# Altium project BMS_V2.1_Adv.PrjPcb (part 2 of 3)

## Sheet Isolated Communication.SchDoc
size A3; SheetNumber: 5; SheetTotal: 12
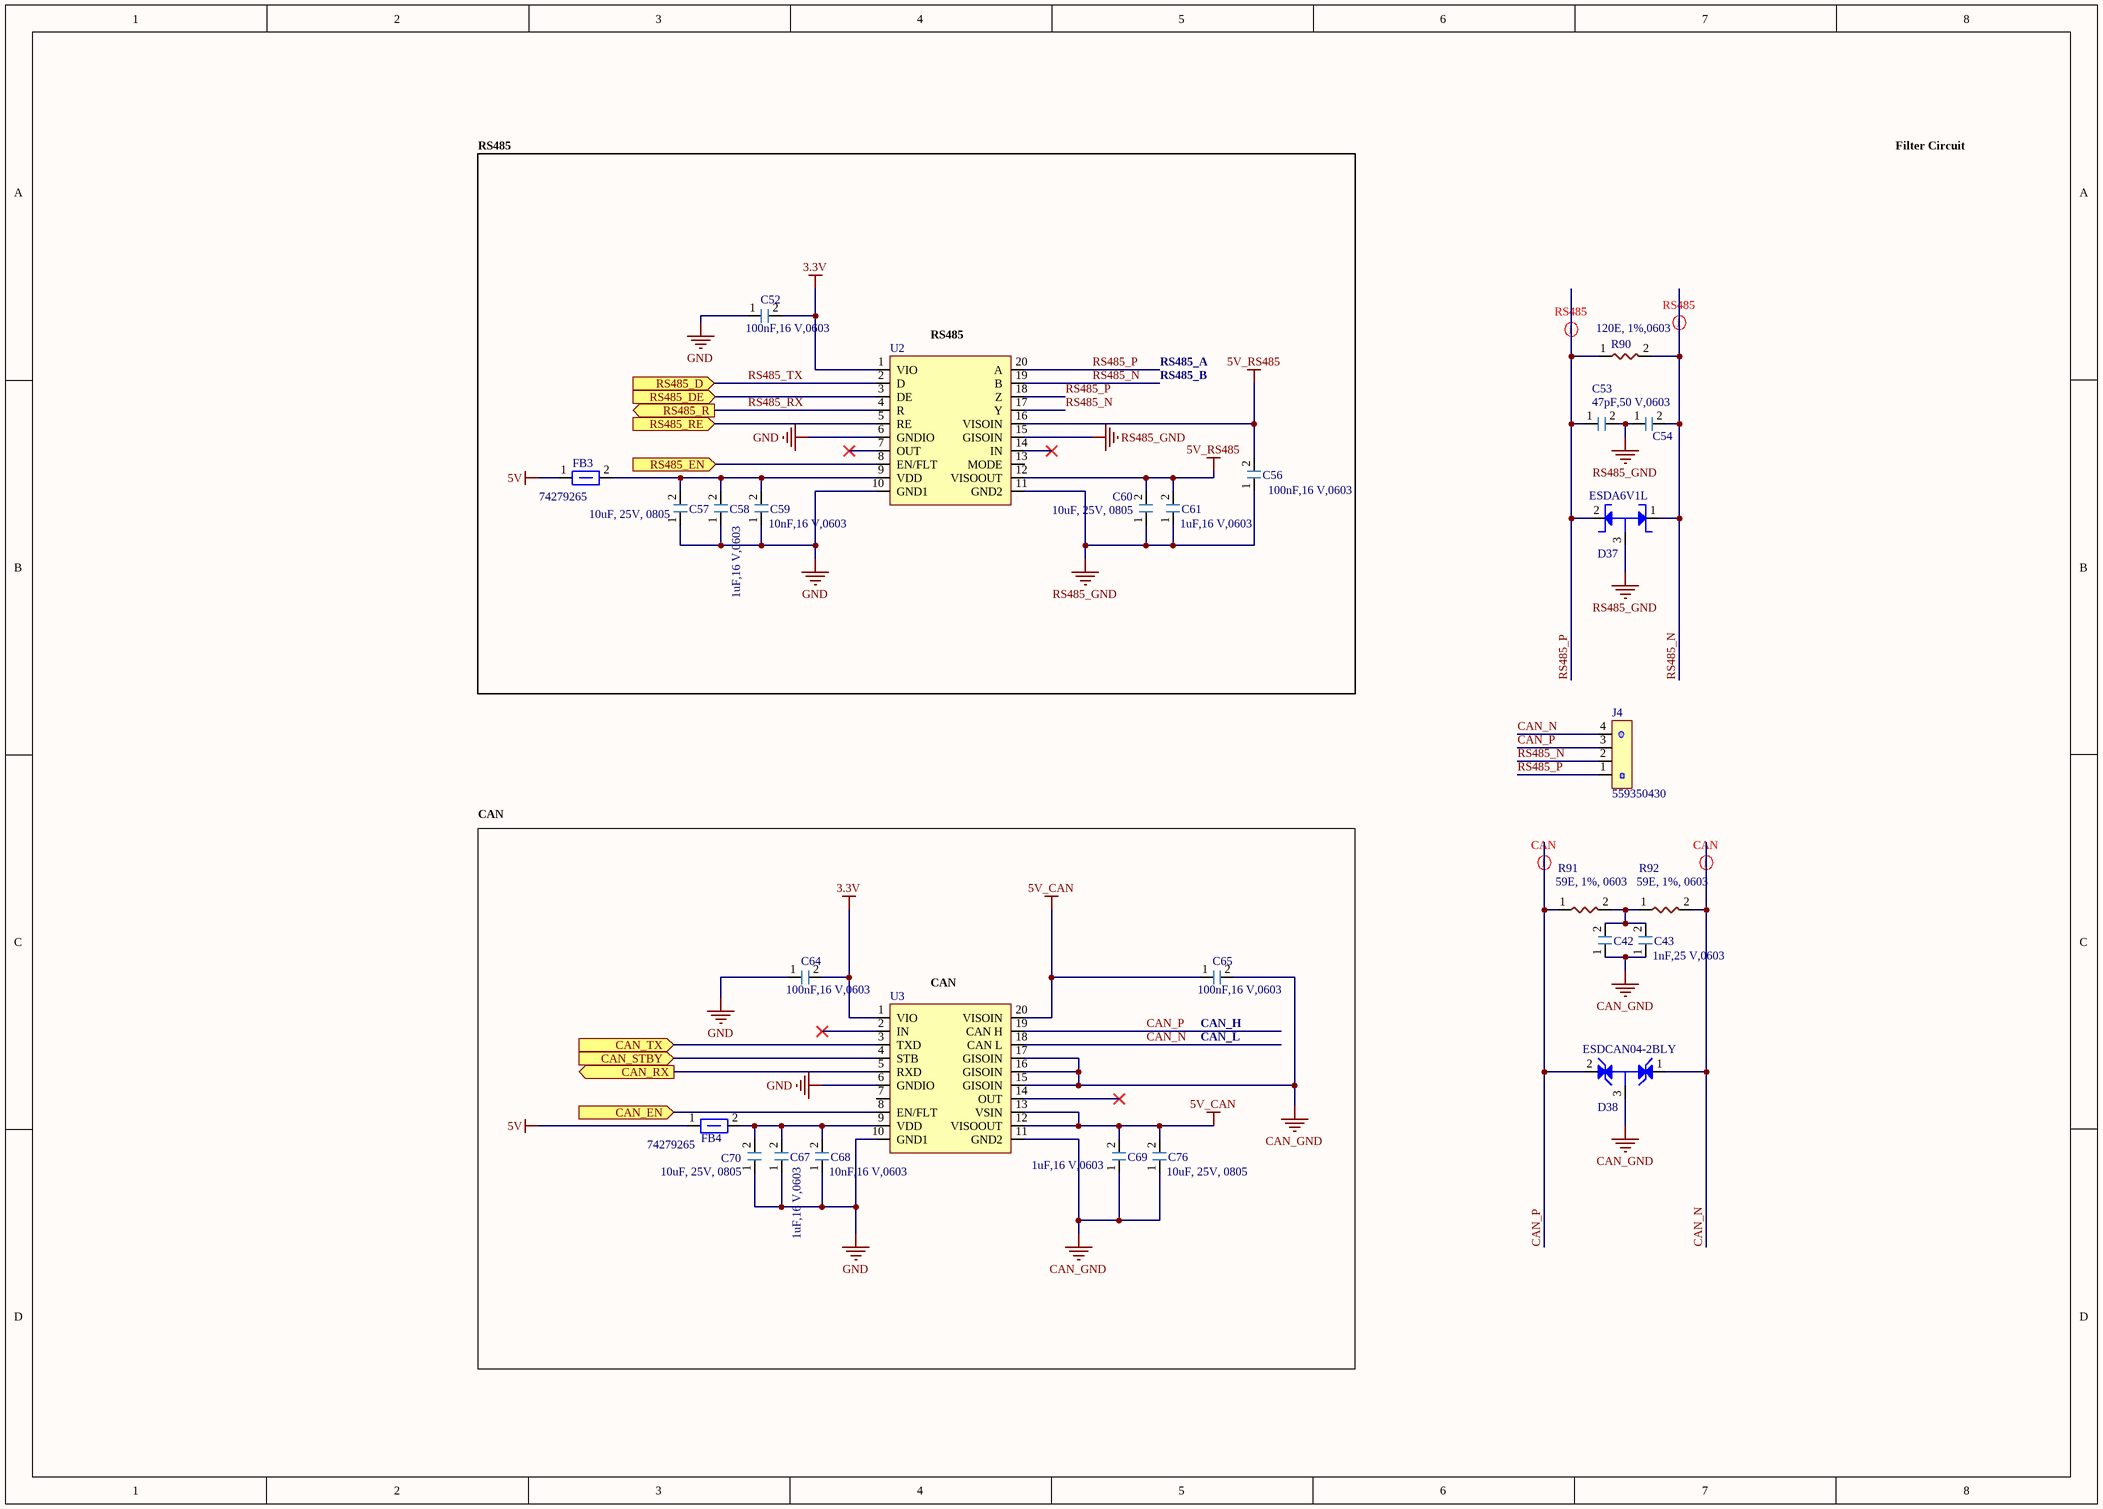
[diagram p4: Isolated Communication.SchDoc]

### Parts
C42  C0603C102J3GACAUTO  [CAPC1608X05N 0603]  (value not drawn)
C43  Value Display: 1nF,25 V,0603  [CAPC1608X05N 0603]  (hidden comment: C0603C102J3GACAUTO)
C52  Value Display: 100nF,16 V,0603  [CAPC1608X05N 0603]  (hidden comment: CC0603KRX7R7BB104)
C53  Value Display: 47pF,50 V,0603  [CAPC1608X05N 0603]  (hidden comment: CC0603JRNPO9BN470)
C54  CC0603JRNPO9BN470  [CAPC1608X05N 0603]  (value not drawn)
C56  Value Display: 100nF,16 V,0603  [CAPC1608X05N 0603]  (hidden comment: CC0603KRX7R7BB104)
C57  Value Display: 10uF, 25V, 0805  [CAPC2012X13N 0805]  (hidden comment: GRM21BZ71E106KE15L)
C58  Value Display: 1uF,16 V,0603  [CAPC1608X05N 0603]  (hidden comment: CGA3E1X7R1C105K080AC)
C59  Value Display: 10nF,16 V,0603  [CAPC1608X05N 0603]  (hidden comment: C0603C103K4RECTU)
C60  Value Display: 10uF, 25V, 0805  [CAPC2012X13N 0805]  (hidden comment: GRM21BZ71E106KE15L)
C61  Value Display: 1uF,16 V,0603  [CAPC1608X05N 0603]  (hidden comment: CGA3E1X7R1C105K080AC)
C64  Value Display: 100nF,16 V,0603  [CAPC1608X05N 0603]  (hidden comment: CC0603KRX7R7BB104)
C65  Value Display: 100nF,16 V,0603  [CAPC1608X05N 0603]  (hidden comment: CC0603KRX7R7BB104)
C67  Value Display: 1uF,16 V,0603  [CAPC1608X05N 0603]  (hidden comment: CGA3E1X7R1C105K080AC)
C68  Value Display: 10nF,16 V,0603  [CAPC1608X05N 0603]  (hidden comment: C0603C103K4RECTU)
C69  Value Display: 1uF,16 V,0603  [CAPC1608X05N 0603]  (hidden comment: CGA3E1X7R1C105K080AC)
C70  Value Display: 10uF, 25V, 0805  [CAPC2012X13N 0805]  (hidden comment: GRM21BZ71E106KE15L)
C76  Value Display: 10uF, 25V, 0805  [CAPC2012X13N 0805]  (hidden comment: GRM21BZ71E106KE15L)
D37  ESDA6V1L  [SOT95P255X140-3N]
D38  ESDCAN04-2BLY  [SOT95P255X125-3N]
FB3  74279265  [RESC1608X05N 0603]
FB4  74279265  [RESC1608X05N 0603]
J4  559350430  [Con_559350430]
R90  Value Display: 120E, 1%,0603  [RESC1608X05N 0603]  (hidden comment: AF0603FR-07120RL)
R91  Value Display: 59E, 1%, 0603  [RESC1608X05N 0603]  (hidden comment: AC0603FR-0759RL)
R92  Value Display: 59E, 1%, 0603  [RESC1608X05N 0603]  (hidden comment: AC0603FR-0759RL)
U2  ISOW1412BDFMR  [SOIC127P1030X355-20N]  (value not drawn)
U3  ISOW1044BDFMR  [SOIC127P1030X355-20N]  (value not drawn)

### Ports
CAN_EN (in), CAN_RX (out), CAN_STBY (in), CAN_TX (in), RS485_D (in), RS485_DE (in), RS485_EN (in), RS485_R (out), RS485_RE (in)

### Nets
3.3V: C52.2 C64.2 U2.1(VIO) U3.1(VIO)
5V: FB3.1 FB4.1
5V_CAN: C65.1 C69.2 C76.2 U3.12(VISOOUT) U3.13(VSIN) U3.20(VISOIN)
5V_RS485: C56.2 C60.2 C61.2 U2.12(VISOOUT) U2.16(VISOIN)
CAN_GND: C42.1 C43.1 C65.2 C69.1 C76.1 D38.3 U3.11(GND2) U3.15(GISOIN) U3.16(GISOIN) U3.17(GISOIN)
GND: C52.1 C57.1 C58.1 C59.1 C64.1 C67.1 C68.1 C70.1 U2.6(GNDIO) U2.10(GND1) U3.6(GNDIO) U3.10(GND1)
RS485_GND: C53.2 C54.1 C56.1 C60.1 C61.1 D37.3(Anode) U2.11(GND2) U2.15(GISOIN)
CAN_EN: U3.8(EN/FLT) ; port CAN_EN
CAN_N: D38.1(Cathode) J4.4 R92.2 U3.18(CAN_L)
CAN_P: D38.2(Anode) J4.3 R91.1 U3.19(CAN_H)
CAN_RX: U3.5(RXD) ; port CAN_RX
CAN_STBY: U3.4(STB) ; port CAN_STBY
CAN_TX: U3.3(TXD) ; port CAN_TX
RS485_DE: U2.3(DE) ; port RS485_DE
RS485_EN: U2.8(EN/FLT) ; port RS485_EN
RS485_N: C54.2 D37.1(Cathode) J4.2 R90.2 U2.17(Y) U2.19(B)
RS485_P: C53.1 D37.2(Cathode) J4.1 R90.1 U2.18(Z) U2.20(A)
RS485_RE: U2.5(RE) ; port RS485_RE
RS485_RX: U2.4(R) ; port RS485_R
RS485_TX: U2.2(D) ; port RS485_D
NetC42_2: C42.2 C43.2 R91.2 R92.1
NetC57_2: C57.2 C58.2 C59.2 FB3.2 U2.9(VDD)
NetC67_2: C67.2 C68.2 C70.2 FB4.2 U3.9(VDD)

Not connected (* = marked no-connect by the designer): U2 7(OUT)* 13(MODE) 14(IN)*; U3 2(IN)* 7 14(OUT)*

### Layout directives
differential pair: CAN_N, CAN_P, RS485_N, RS485_P

### Notes on the sheet
- RS485
- Filter Circuit
- (near U2) RS485
- RS485_A
- RS485_B
- CAN
- (near U3) CAN
- (near C65) CAN_H
- CAN_L

### Library data of the parts
C42 = Cap_C0603C102J3GACAUTO: Multilayer Ceramic Capacitor, 1000 pF, 25V, ±5%,  C0G 0603 [1608 Metric]; Manufacturer: KEMET; Value: 1nF; Max Temp: 125 degC; Min Temp: -55 degC; Polarized: No; Temp Coefficient: C0G, NP0; Value Display: 1nF,25 V,0603; AEC-Q: 200; Manufacturer Part Number: C0603C102J3GACAUTO; Voltage: 25V; Category: Capacitor; ComponentLink1Description: Datasheet; Mount Type: Surface Mount; Package: 0603; RoHS: Yes; Supplier 1: Digikey; Supplier 1 Part Number: 399-C0603C102J3GACAUTOCT-ND; Supplier 1 pricing per Unit: 9.17 INR; Supplier: Mouser; Supplier Part Number: 80-C0603C102J3GAUTO; Supplier pricing per Unit: 8.34 INR; Technology: Ceramic; Tolerance: 5%; Value 1: C0603C102J3GACAUTO; ComponentLink1URL: https://connect.kemet.com:7667/gateway/IntelliData-ComponentDocumentation/1.0/download/datasheet/C0603C102J3GACAUTO
C43 = Cap_C0603C102J3GACAUTO: Multilayer Ceramic Capacitor, 1000 pF, 25V, ±5%,  C0G 0603 [1608 Metric]; Manufacturer: KEMET; Value: 1nF; Max Temp: 125 degC; Min Temp: -55 degC; Polarized: No; Temp Coefficient: C0G, NP0; AEC-Q: 200; Manufacturer Part Number: C0603C102J3GACAUTO; Voltage: 25V; Category: Capacitor; ComponentLink1Description: Datasheet; Mount Type: Surface Mount; Package: 0603; RoHS: Yes; Supplier 1: Digikey; Supplier 1 Part Number: 399-C0603C102J3GACAUTOCT-ND; Supplier 1 pricing per Unit: 9.17 INR; Supplier: Mouser; Supplier Part Number: 80-C0603C102J3GAUTO; Supplier pricing per Unit: 8.34 INR; Technology: Ceramic; Tolerance: 5%; Value 1: C0603C102J3GACAUTO; ComponentLink1URL: https://connect.kemet.com:7667/gateway/IntelliData-ComponentDocumentation/1.0/download/datasheet/C0603C102J3GACAUTO
C52 C56 C64 C65 = Cap_CC0603KRX7R7BB104: Multilayer Ceramic Capacitor, 100 nF, 16V, ±10%,  X7R 0603 [1608 Metric]; Manufacturer: Yageo; Value: 100nF; Max Temp: 125 degC; Min Temp: -55 degC; Polarized: No; AEC-Q: NA; Manufacturer Part Number: CC0603KRX7R7BB104; Category: Capacitor; ComponentLink1Description: Datasheet; Mount Type: Surface Mount; Package: 0603; RoHS: Yes; Supplier 1: Digikey; Supplier 1 Part Number: 311-1088-1-ND; Supplier 1 pricing per Unit: 8.34 INR; Supplier: Mouser; Supplier Part Number: 603-CC603KRX7R7BB104; Supplier pricing per Unit: 8.34 INR; Technology: Ceramic; Temp Coefficient: X7R; Tolerance: 10%; Value 1: CC0603KRX7R7BB104; Voltage: 16V; ComponentLink1URL: https://www.yageo.com/upload/media/product/productsearch/datasheet/mlcc/UPY-GPHC_X7R_6.3V-to-250V_24.pdf
C53 = Cap_CC0603JRNPO9BN470: Multilayer Ceramic Capacitor, 47 pF, 50V, ±5%,  C0G 0603 [1608 Metric]; Manufacturer: Yageo; AEC-Q: NA; Max Temp: 125 degC; Min Temp: -55 degC; Polarized: No; Temp Coefficient: C0G, NP0; Value: 47pF; Manufacturer Part Number: CC0603JRNPO9BN470; Category: Capacitor; ComponentLink1Description: Datasheet; ComponentLink1URL: https://www.yageo.com/upload/media/product/productsearch/datasheet/mlcc/UPY-GP_NP0_16V-to-50V_18.pdf; Mount Type: Surface Mount; Package: 0603; RoHS: Yes; Supplier 1: Digikey; Supplier 1 Part Number: 311-1065-1-ND; Supplier 1 pricing per Unit: 8.34 INR; Supplier: Mouser; Supplier Part Number: 603-CC603JRNPO9BN470; Supplier pricing per Unit: 8.34 INR; Technology: Ceramic; Tolerance: 5%; Value 1: CC0603JRNPO9BN470; Voltage: 50V
C54 = Cap_CC0603JRNPO9BN470: Multilayer Ceramic Capacitor, 47 pF, 50V, ±5%,  C0G 0603 [1608 Metric]; Manufacturer: Yageo; AEC-Q: NA; Max Temp: 125 degC; Min Temp: -55 degC; Polarized: No; Temp Coefficient: C0G, NP0; Value: 47pF; Value Display: 47pF,50 V,0603; Manufacturer Part Number: CC0603JRNPO9BN470; Category: Capacitor; ComponentLink1Description: Datasheet; ComponentLink1URL: https://www.yageo.com/upload/media/product/productsearch/datasheet/mlcc/UPY-GP_NP0_16V-to-50V_18.pdf; Mount Type: Surface Mount; Package: 0603; RoHS: Yes; Supplier 1: Digikey; Supplier 1 Part Number: 311-1065-1-ND; Supplier 1 pricing per Unit: 8.34 INR; Supplier: Mouser; Supplier Part Number: 603-CC603JRNPO9BN470; Supplier pricing per Unit: 8.34 INR; Technology: Ceramic; Tolerance: 5%; Value 1: CC0603JRNPO9BN470; Voltage: 50V
C57 C60 C70 C76 = Cap_GRM21BZ71E106KE15L: Multilayer Ceramic Capacitor, 10 uF, 25V, ±10%,  X7R 0805 (2012 Metric); Manufacturer: Murata; AEC-Q: NA; Max Temp: 125 degC; Min Temp: -55 degC; Polarized: No; Value: 10 uF; Category: Capacitor; ComponentLink1Description: Datasheet; ComponentLink1URL: https://search.murata.co.jp/Ceramy/image/img/A01X/G101/ENG/GRM21BZ71E106KE15-01.pdf; Manufacturer Part Number: GRM21BZ71E106KE15L; Mount Type: Surface Mount; Package: 0805; RoHS: Yes; Supplier 1: Digikey; Supplier 1 Part Number: 490-GRM21BZ71E106KE15LCT-ND; Supplier 1 pricing per Unit: 28.51 INR; Supplier: Mouser; Supplier Part Number: 81-GRM21BZ71E106KE5L; Supplier pricing per Unit: 30.02 INR; Technology: Ceramic; Temp Coefficient: X7R; Tolerance: 10%; Value 1: GRM21BZ71E106KE15L; Voltage: 25V
C58 C61 C67 C69 = Cap_CGA3E1X7R1C105K080AC: as C19 on sheet Monitoring_BQ76952; Value: 1 uF; Manufacturer Part Number: CGA3E1X7R1C105K080AC; Package: 0603; RoHS: Yes; Mount Type: Surface Mount; Supplier 1: Digikey; Voltage: 16V; Tolerance: 10%; Technology: Ceramic; Value 1: CGA3E1X7R1C105K080AC; Category: Capacitor; ComponentLink1Description: Datasheet; ComponentLink1URL: https://product.tdk.com/system/files/dam/doc/product/capacitor/ceramic/mlcc/catalog/mlcc_automotive_general_en.pdf; Supplier 1 Part Number: 445-12539-1-ND; Supplier 1 pricing per Unit: 10.84 INR; Supplier: Mouser; Supplier Part Number: 810-CGA3E1X7R1C105AC; Supplier pricing per Unit: 10.01 INR; Temp Coefficient: X7R
C59 C68 = Cap_C0603C103K4RECTU: Multilayer Ceramic Capacitor, 10 nF, 16V, ±10%,  X7R 0603 [1608 Metric]; Manufacturer: KEMET; AEC-Q: NA; Max Temp: 125 degC; Min Temp: -55 degC; Polarized: No; Value: 10 nF; Category: Capacitor; ComponentLink1Description: Datasheet; ComponentLink1URL: https://content.kemet.com/datasheets/KEM_C1090_X7R_ESD.pdf; Manufacturer Part Number: C0603C103K4RECTU; Mount Type: Surface Mount; Package: 0603; RoHS: Yes; Supplier 1: Digikey; Supplier 1 Part Number: 399-C0603C103K4REC7867CT-ND; Supplier 1 pricing per Unit: 9.21 INR; Supplier: Mouser; Supplier Part Number: 80-C0603C103K4RECTU; Supplier pricing per Unit: 8.34 INR; Technology: Ceramic; Temp Coefficient: X7R; Tolerance: 10%; Value 1: C0603C103K4RECTU; Voltage: 16V
D37 = Diode_TVS_ESDA6V1L: Clamp Ipp Tvs Diode Surface Mount SOT-23-3 Unidirectional; Manufacturer: ST; AEC-Q: NA; Max Temp: 125 degC; Min Temp: -40 degC; Power: 300W; Voltage: 6.1V; Category: TVS Diode; ComponentLink1Description: Datasheet; ComponentLink1URL: https://www.st.com/content/ccc/resource/technical/document/datasheet/eb/9f/a7/ac/7b/b6/46/7f/CD00002057.pdf/files/CD00002057.pdf/jcr:content/translations/en.CD00002057.pdf; Manufacturer Part Number: ESDA6V1L; Mount Type: Surface Mount; Package: SOT 23-3; RoHS: Yes; Supplier 1: Digikey; Supplier 1 Part Number: 497-2930-1-ND; Supplier 1 pricing per Unit: 31.71 INR; Supplier: Mouser; Supplier Part Number: 511-ESDA6V1L; Supplier pricing per Unit: 33.36 INR; Value 1: ESDA6V1L; VALUE: ESDA6V1L; Value Display: ESDA6V1L
D38 = Diode_TVS_ESDCAN04-2BLY: 43V Clamp 3.7A (8/20µs) Ipp Tvs Diode Surface Mount SOT-23-3 Bidirectional; Manufacturer: ST; AEC-Q: 101; Max Temp: 150 degC; Min Temp: -40 degC; Power: 230W; Category: TVS Diode; ComponentLink1Description: Datasheet; ComponentLink1URL: https://www.st.com/resource/en/datasheet/esdcan01-2bly.pdf; Manufacturer Part Number: ESDCAN04-2BLY; Mount Type: Surface Mount; Package: SOT 23-3; RoHS: Yes; Supplier 1: Digikey; Supplier 1 Part Number: 497-19089-1-ND; Supplier 1 pricing per Unit: 35.05 INR; Supplier: Mouser; Supplier Part Number: 511-ESDCAN04-2BLY; Supplier pricing per Unit: 34.19 INR; Value 1: ESDCAN04-2BLY; VALUE: ESDCAN04-2BLY; Value Display: ESDCAN04-2BLY; Voltage: 43V
FB3 FB4 = FB_74279265: 600 Ohms @ 100 MHz 1 Signal Line Ferrite Bead 0603 (1608 Metric) 200mA 450mOhm; Manufacturer: Wurth Electronik; AEC-Q: 200; Max Temp: 125 degC; Min Temp: -55 degC; Value 1: 600 Ohms @100MHHz; Category: Ferrite Bead; ComponentLink1Description: Datasheet; ComponentLink1URL: https://www.we-online.com/components/products/datasheet/74279265.pdf; Manufacturer Part Number: 74279265; Mount Type: Surface Mount; Package: 0603; RoHS: Yes; Supplier 1: Digikey; Supplier 1 Part Number: 732-1583-1-ND; Supplier 1 pricing per Unit: 15.07 INR; Supplier: Mouser; Supplier Part Number: 710-74279265; Supplier pricing per Unit: 14.10 INR; Value: 74279265; Value Display: 600 Ohms
J4 = Con_559350430: 2.00mm Pitch MicroClasp Wire-to-Board Header, Dual Row, Right Angle, 4 Circuits; Crimp Part Number: 561349000; Manufacturer: Molex; Manufacturer Part Number: 0559350430; Mating Part Number: 513820400; Circuits: 4; AEC-Q: NA; Rows: 1; Value: 4 Pin; Value Display: 4 Pin/RA/TH; Category: Connector; Colour: Natural; ComponentLink1Description: Datasheet; Pitch: 2.00 mm; ComponentLink1URL: https://www.molex.com/en-us/products/part-detail-pdf/559350430?display=pdf; Mount Type: TH; Package: THT; RoHS: Yes; Supplier 1: Digikey; Supplier 1 Part Number: WM12300-ND; Supplier 1 pricing per Unit: 36.05 INR; Supplier: Mouser; Supplier Part Number: 538-55935-0430; Supplier pricing per Unit: 28.36 INR; Value 1: 559350430
R90 = Res_AF0603FR-07120RL: SMD Chip Resistor,120 Ohms ±1%, 1/10W, 0603 (1608 Metric) Anti-Sulfur, Automotive AEC-Q200 Thick Film; Manufacturer: Yageo; AEC-Q: 200; Max Temp: 155 degC; Min Temp: -55 degC; Value: 120R; Category: Resistor; ComponentLink1Description: Datasheet; ComponentLink1URL: https://www.yageo.com/upload/media/product/app/datasheet/rchip/pyu-af_51_rohs_l.pdf; Manufacturer Part Number: AF0603FR-07120RL; Mount Type: Surface Mount; Package: 0603; Power: 1/10W; RoHS: Yes; Supplier 1: Digikey; Supplier 1 Part Number: 13-AF0603FR-07120RLCT-ND; Supplier 1 pricing per Unit: 8.34 INR; Supplier: Mouser; Supplier Part Number: 603-AF0603FR-07120RL; Supplier pricing per Unit: 8.34 INR; Tolerance: 1%; Value 1: AF0603FR-07120RL
R91 R92 = Res_AC0603FR-0759RL: SMD Chip Resistor,59 Ohms ±1% 0.1W, 1/10W, 0603 (1608 Metric) Anti-Sulfur, Automotive AEC-Q200 Thick Film; Manufacturer: Yageo; AEC-Q: 200; Max Temp: 155 degC; Min Temp: -55 degC; Value: 59R; Category: Resistor; ComponentLink1Description: Datasheet; ComponentLink1URL: https://www.yageo.com/upload/media/product/productsearch/datasheet/rchip/PYu-AC_51_RoHS_L_10.pdf; Manufacturer Part Number: AC0603FR-0759RL; Mount Type: Surface Mount; Package: 0603; Power: 1/10W; RoHS: Yes; Supplier 1: Digikey; Supplier 1 Part Number: 13-AC0603FR-0759RLCT-ND; Supplier 1 pricing per Unit: 8.34 INR; Supplier: Mouser; Supplier Part Number: 603-AC0603FR-0759RL; Supplier pricing per Unit: 8.34 INR; Tolerance: 1%; Value 1: AC0603FR-0759RL
U2 = IC_ISOW1412BDFMR: RS-422/RS-485 Interface IC EMC protected, 500-Kbps, full-duplex, 5-kVrms isolated RS-485 & RS-422 transceiver 16-SOIC -40 to 125; Manufacturer: Texas Instruments; AEC-Q: NA; Max Temp: 125 degC; Min Temp: -40 degC; Manufacturer Part Number: ISOW1412BDFMR; Category: Isolated RS485; ComponentLink1Description: Datasheet; ComponentLink1URL: https://www.ti.com/lit/ds/symlink/isow1432.pdf?ts=1718250901222&ref_url=https%253A%252F%252Fwww.mouser.in%252F; Mount Type: Surface Mount; Package: DFM; RoHS: Yes; Supplier 1: Digikey; Supplier 1 Part Number: 296-ISOW1412BDFMRCT-ND; Supplier 1 pricing per Unit: 742.42 INR; Supplier: Mouser; Supplier Part Number: 595-ISOW1412BDFMR; Supplier pricing per Unit: 885.71 INR; Value 1: ISOW1412BDFMR; Value: ISOW1412BDFMR; Value Display: ISOW1412BDFMR
U3 = IC_ISOW1044BDFMR: 1/1 Transceiver, Isolated Half CANbus 20-SOIC; Manufacturer: Texas Instruments; AEC-Q: NA; Max Temp: 125 degC; Min Temp: -40 degC; Manufacturer Part Number: ISOW1044BDFMR; Category: Isolated CAN; ComponentLink1Description: Datasheet; ComponentLink1URL: https://www.ti.com/lit/ds/symlink/isow1044.pdf?ts=1694787726249&ref_url=https%253A%252F%252Fwww.ti.com%252Fsitesearch%252Fen-us%252Fdocs%252Funiversalsearch.tsp%253FlangPref%253Den-US%2526searchTerm%253DISOW1044BDFMR%2526nr%253D6; Mount Type: Surface Mount; Package: DFM; RoHS: Yes; Supplier 1: Digikey; Supplier 1 Part Number: 296-ISOW1044BDFMRCT-ND; Supplier 1 pricing per Unit: 736.25 INR; Supplier: Mouser; Supplier Part Number: 595-ISOW1044BDFMR; Supplier pricing per Unit: 881.54 INR; Value 1: ISOW1044BDFMR; Value: ISOW1044BDFMR; Value Display: ISOW1044BDFMR

## Sheet MOSFET Connections.SchDoc
size A3; SheetNumber: 3; SheetTotal: 12
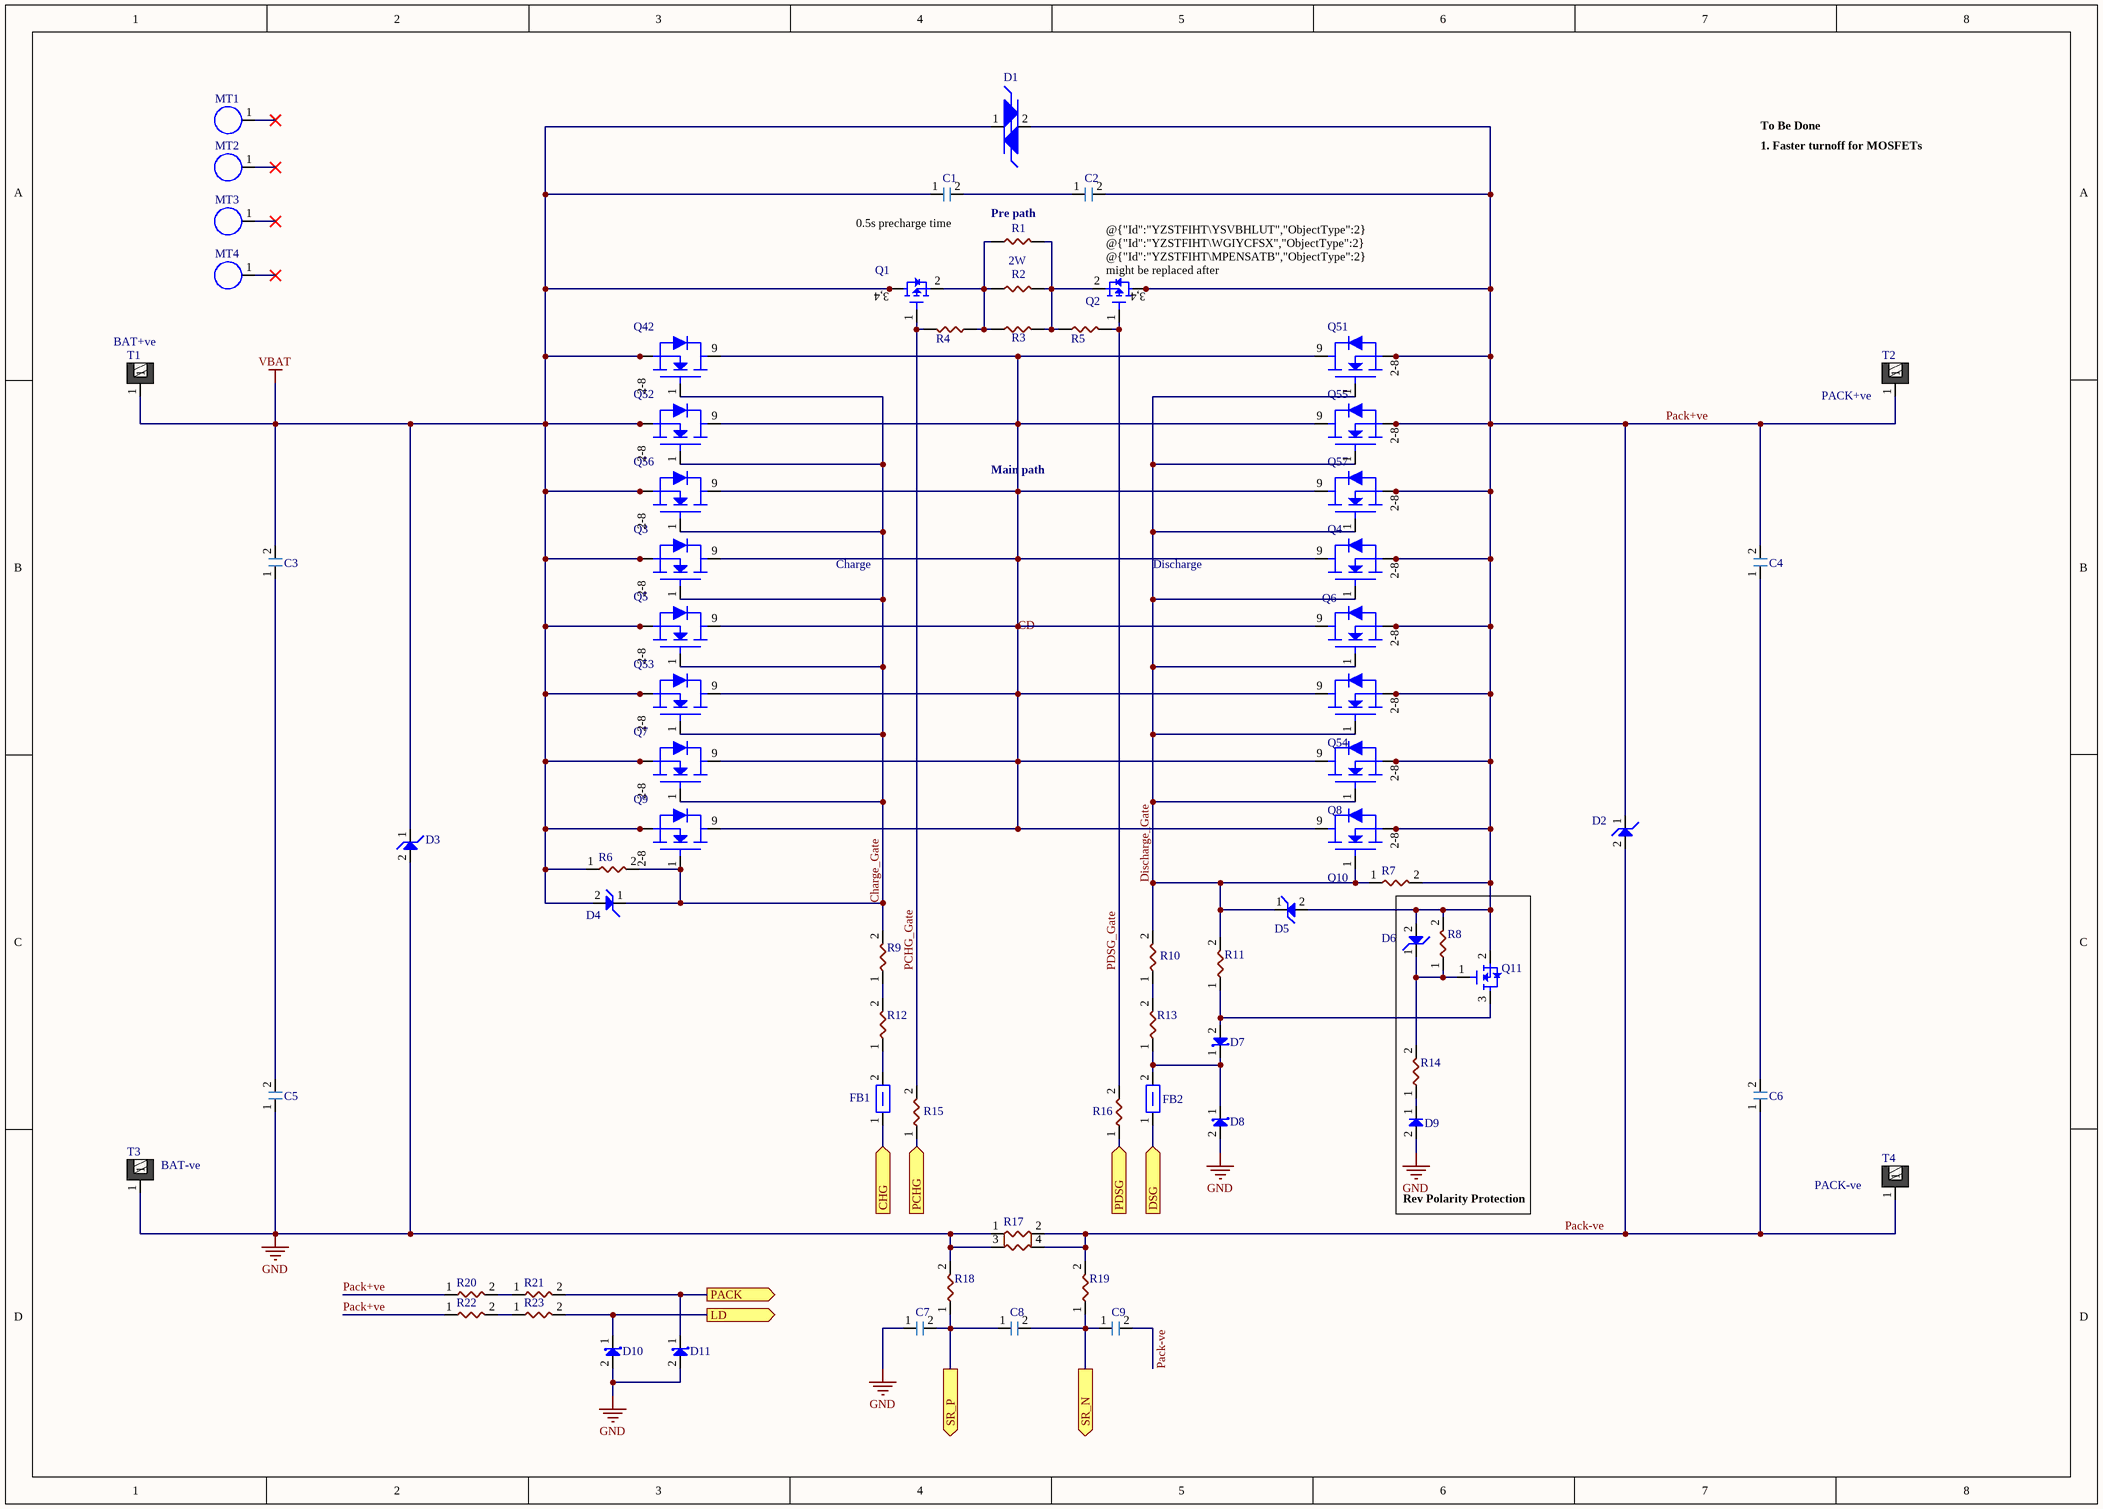
[diagram p5: MOSFET Connections.SchDoc]

### Parts
C1  CC0603KRX7R0BB104  [CAPC1608X05N 0603]  (value not drawn)
C2  CC0603KRX7R0BB104  [CAPC1608X05N 0603]  (value not drawn)
C3  CC0603KRX7R0BB104  [CAPC1608X05N 0603]  (value not drawn)
C4  CC0603KRX7R0BB104  [CAPC1608X05N 0603]  (value not drawn)
C5  CC0603KRX7R0BB104  [CAPC1608X05N 0603]  (value not drawn)
C6  CC0603KRX7R0BB104  [CAPC1608X05N 0603]  (value not drawn)
C7  GRM188R72A104KA35D  [CAPC1608X05N 0603]  (value not drawn)
C8  GRM188R72A104KA35D  [CAPC1608X05N 0603]  (value not drawn)
C9  GRM188R72A104KA35D  [CAPC1608X05N 0603]  (value not drawn)
D1  SMP100LC-140  [DIODE_SMP100LC-140]  (value not drawn)
D2  SMDJ70A  [DIODE_SMDJ70A]  (value not drawn)
D3  SMDJ70A  [DIODE_SMDJ70A]  (value not drawn)
D4  MMSZ5246BQ-7-F  [DIODE_SOD123]  (value not drawn)
D5  MMSZ5246BQ-7-F  [DIODE_SOD123]  (value not drawn)
D6  MMSZ5246BQ-7-F  [DIODE_SOD123]  (value not drawn)
D7  BAT46W-7-F  [DIODE_SOD123]  (value not drawn)
D8  BAT46W-7-F  [DIODE_SOD123]  (value not drawn)
D9  SBAS16HT1G  [DIODE_SOD323]  (value not drawn)
D10  BAT46W-7-F  [DIODE_SOD123]  (value not drawn)
D11  BAT46W-7-F  [DIODE_SOD123]  (value not drawn)
FB1  74279265  [RESC1608X05N 0603]  (value not drawn)
FB2  74279265  [RESC1608X05N 0603]  (value not drawn)
MT1  M3 Mounting Hole  [Mounting Hole]  (value not drawn)  (no BOM)
MT2  M3 Mounting Hole  [Mounting Hole]  (value not drawn)  (no BOM)
MT3  M3 Mounting Hole  [Mounting Hole]  (value not drawn)  (no BOM)
MT4  M3 Mounting Hole  [Mounting Hole]  (value not drawn)  (no BOM)
Q1  ZXMP10A17GQTA  [SOT230P700X180-4N]  (value not drawn)
Q2  ZXMP10A17GQTA  [SOT230P700X180-4N]  (value not drawn)
Q3  NVBLS0D8N08XTXG  [DPAK120P1168X240-9N]  (value not drawn)
Q4  NVBLS0D8N08XTXG  [DPAK120P1168X240-9N]  (value not drawn)
Q5  NVBLS0D8N08XTXG  [DPAK120P1168X240-9N]  (value not drawn)
Q6  NVBLS0D8N08XTXG  [DPAK120P1168X240-9N]  (value not drawn)
Q7  NVBLS0D8N08XTXG  [DPAK120P1168X240-9N]  (value not drawn)
Q8  NVBLS0D8N08XTXG  [DPAK120P1168X240-9N]  (value not drawn)
Q9  NVBLS0D8N08XTXG  [DPAK120P1168X240-9N]  (value not drawn)
Q10  NVBLS0D8N08XTXG  [DPAK120P1168X240-9N]  (value not drawn)
Q11  2N7002KW  [SOT65P210X110-3N]  (value not drawn)
Q42  NVBLS0D8N08XTXG  [DPAK120P1168X240-9N]  (value not drawn)
Q51  NVBLS0D8N08XTXG  [DPAK120P1168X240-9N]  (value not drawn)
Q52  NVBLS0D8N08XTXG  [DPAK120P1168X240-9N]  (value not drawn)
Q53  NVBLS0D8N08XTXG  [DPAK120P1168X240-9N]  (value not drawn)
Q54  NVBLS0D8N08XTXG  [DPAK120P1168X240-9N]  (value not drawn)
Q55  NVBLS0D8N08XTXG  [DPAK120P1168X240-9N]  (value not drawn)
Q56  NVBLS0D8N08XTXG  [DPAK120P1168X240-9N]  (value not drawn)
Q57  NVBLS0D8N08XTXG  [DPAK120P1168X240-9N]  (value not drawn)
R1  AC2512FK-7W200RL  [RESC6332X07N 2512]  (value not drawn)
R2  AC2512FK-7W200RL  [RESC6332X07N 2512]  (value not drawn)
R3  AC2512FK-7W200RL  [RESC6332X07N 2512]  (value not drawn)
R4  CRCW060310M0JNEA  [RESC1608X05N 0603]  (value not drawn)
R5  CRCW060310M0JNEA  [RESC1608X05N 0603]  (value not drawn)
R6  CRCW060310M0JNEA  [RESC1608X05N 0603]  (value not drawn)
R7  CRCW060310M0JNEA  [RESC1608X05N 0603]  (value not drawn)
R8  CRCW060310M0JNEA  [RESC1608X05N 0603]  (value not drawn)
R9  CRCW06035K10JNEA  [RESC1608X05N 0603]  (value not drawn)
R10  CRCW06035K10JNEA  [RESC1608X05N 0603]  (value not drawn)
R11  CRCW06035K10JNEA  [RESC1608X05N 0603]  (value not drawn)
R12  CRCW06035K10JNEA  [RESC1608X05N 0603]  (value not drawn)
R13  CRCW06035K10JNEA  [RESC1608X05N 0603]  (value not drawn)
R14  CRCW060310K0FKEA  [RESC1608X05N 0603]  (value not drawn)
R15  CRCW06035K10JNEA  [RESC1608X05N 0603]  (value not drawn)
R16  CRCW06035K10JNEA  [RESC1608X05N 0603]  (value not drawn)
R17  WSLP2726L5000FEA  [WSLP2726-X- NS]  (value not drawn)
R18  AF0603FR-07100RL  [RESC1608X05N 0603]  (value not drawn)
R19  AF0603FR-07100RL  [RESC1608X05N 0603]  (value not drawn)
R20  CRCW12065K10JNEA  [RESC3216X06N 1206]  (value not drawn)
R21  CRCW12065K10JNEA  [RESC3216X06N 1206]  (value not drawn)
R22  CRCW12065K10JNEA  [RESC3216X06N 1206]  (value not drawn)
R23  CRCW12065K10JNEA  [RESC3216X06N 1206]  (value not drawn)
T1  7461057  [7461057]  (value not drawn)
T2  7461057  [7461057]  (value not drawn)
T3  7461057  [7461057]  (value not drawn)
T4  7461057  [7461057]  (value not drawn)

### Blocks framed on the sheet
Rev Polarity Protection: D6 D9 Q11 R8 R14

### Ports
CHG (in), DSG (in), LD (out), PACK (out), PCHG (in), PDSG (in), SR_N (out), SR_P (out)

### Nets
GND: C5.1 C7.1 D3.2(Anode) D8.2(Anode) D9.2(Anode) D10.2(Anode) D11.2(Anode) R17.1 R17.3 R18.2 T3.1
VBAT: C1.1 C3.2 D1.1 D3.1(Cathode) D4.2(Anode) Q1.3(Drain) Q1.4(Drain) Q3.2(Source) Q3.3(Source) Q3.4(Source) Q3.5(Source) Q3.6(Source) Q3.7(Source) Q3.8(Source) Q5.2(Source) Q5.3(Source) Q5.4(Source) Q5.5(Source) Q5.6(Source) Q5.7(Source) Q5.8(Source) Q7.2(Source) Q7.3(Source) Q7.4(Source) Q7.5(Source) Q7.6(Source) Q7.7(Source) Q7.8(Source) Q9.2(Source) Q9.3(Source) Q9.4(Source) Q9.5(Source) Q9.6(Source) Q9.7(Source) Q9.8(Source) Q42.2(Source) Q42.3(Source) Q42.4(Source) Q42.5(Source) Q42.6(Source) Q42.7(Source) Q42.8(Source) Q52.2(Source) Q52.3(Source) Q52.4(Source) Q52.5(Source) Q52.6(Source) Q52.7(Source) Q52.8(Source) Q53.2(Source) Q53.3(Source) Q53.4(Source) Q53.5(Source) Q53.6(Source) Q53.7(Source) Q53.8(Source) Q56.2(Source) Q56.3(Source) Q56.4(Source) Q56.5(Source) Q56.6(Source) Q56.7(Source) Q56.8(Source) R6.1 T1.1
CD: Q3.9(Drain) Q4.9(Drain) Q5.9(Drain) Q6.9(Drain) Q7.9(Drain) Q8.9(Drain) Q9.9(Drain) Q10.9(Drain) Q42.9(Drain) Q51.9(Drain) Q52.9(Drain) Q53.9(Drain) Q54.9(Drain) Q55.9(Drain) Q56.9(Drain) Q57.9(Drain)
Charge_Gate: D4.1(Cathode) Q3.1(Gate) Q5.1(Gate) Q7.1(Gate) Q9.1(Gate) Q42.1(Gate) Q52.1(Gate) Q53.1(Gate) Q56.1(Gate) R6.2 R9.2
CHG_AFE: FB1.1 ; port CHG
Discharge_Gate: D5.1(Cathode) Q4.1(Gate) Q6.1(Gate) Q8.1(Gate) Q10.1(Gate) Q51.1(Gate) Q54.1(Gate) Q55.1(Gate) Q57.1(Gate) R7.1 R10.2 R11.2
DSG_AFE: FB2.1 ; port DSG
LD_AFE: D10.1(Cathode) R23.2 ; port LD
Pack+ve: C2.2 C4.2 D1.2 D2.1(Cathode) D5.2(Anode) D6.2(Anode) Q2.3(Drain) Q2.4(Drain) Q4.2(Source) Q4.3(Source) Q4.4(Source) Q4.5(Source) Q4.6(Source) Q4.7(Source) Q4.8(Source) Q6.2(Source) Q6.3(Source) Q6.4(Source) Q6.5(Source) Q6.6(Source) Q6.7(Source) Q6.8(Source) Q8.2(Source) Q8.3(Source) Q8.4(Source) Q8.5(Source) Q8.6(Source) Q8.7(Source) Q8.8(Source) Q10.2(Source) Q10.3(Source) Q10.4(Source) Q10.5(Source) Q10.6(Source) Q10.7(Source) Q10.8(Source) Q11.2(Source) Q51.2(Source) Q51.3(Source) Q51.4(Source) Q51.5(Source) Q51.6(Source) Q51.7(Source) Q51.8(Source) Q54.2(Source) Q54.3(Source) Q54.4(Source) Q54.5(Source) Q54.6(Source) Q54.7(Source) Q54.8(Source) Q55.2(Source) Q55.3(Source) Q55.4(Source) Q55.5(Source) Q55.6(Source) Q55.7(Source) Q55.8(Source) Q57.2(Source) Q57.3(Source) Q57.4(Source) Q57.5(Source) Q57.6(Source) Q57.7(Source) Q57.8(Source) R7.2 R8.2 R20.1 R22.1 T2.1
Pack-ve: C6.1 C9.2 D2.2(Anode) R17.2 R17.4 R19.2 T4.1
PACK_AFE: D11.1(Cathode) R21.2 ; port PACK
PCHG_AFE: R15.1 ; port PCHG
PCHG_Gate: Q1.1(Gate) R4.2 R15.2
PDSG_AFE: R16.1 ; port PDSG
PDSG_Gate: Q2.1(Gate) R5.2 R16.2
SR_N: C8.2 C9.1 R19.1 ; port SR_N
SR_P: C7.2 C8.1 R18.1 ; port SR_P
NetC1_2: C1.2 C2.1
NetC3_1: C3.1 C5.2
NetC4_1: C4.1 C6.2
NetD6_1: D6.1(Cathode) Q11.1(Gate) R8.1 R14.2
NetD7_1: D7.1(Cathode) D8.1(Cathode) FB2.2 R13.1
NetD7_2: D7.2(Anode) Q11.3(Drain) R11.1
NetD9_1: D9.1(Cathode) R14.1
NetFB1_2: FB1.2 R12.1
NetQ1_2: Q1.2(Source) R1.1 R2.1 R3.1 R4.1
NetQ2_2: Q2.2(Source) R1.2 R2.2 R3.2 R5.1
NetR9_1: R9.1 R12.2
NetR10_1: R10.1 R13.2
NetR20_2: R20.2 R21.1
NetR22_2: R22.2 R23.1

Not connected (* = marked no-connect by the designer): MT1 1*; MT2 1*; MT3 1*; MT4 1*

### Notes on the sheet
- 1. Faster turnoff for MOSFETs
- To Be Done
- (near C1) 0.5s precharge time
- (near R1) Pre path
- 2W
- (near Q2) @{"Id":"YZSTFIHT\YSVBHLUT","ObjectType":2} @{"Id":"YZSTFIHT\WGIYCFSX","ObjectType":2} @{"Id":"YZSTFIHT\MPENSATB","ObjectType":2} might be replaced after testing. Increase resistance in case of heating
- (near T1) BAT+ve
- (near T2) PACK+ve
- Main path
- Charge
- Discharge
- (near T3) BAT-ve
- (near T4) PACK-ve
- (in symbol FET_NVBLS0D8N08XTXG) 2-8
- (in symbol FET_ZXMP10A17GQTA) 3,4

### Library data of the parts
C1-C6 = Cap_CC0603KRX7R0BB104: Multilayer Ceramic Capacitor, 0.1uF, 100V, ±10%,  X7R 0603 [1608 Metric]; Manufacturer: Yageo; AEC-Q: NA; Max Temp: 125 degC; Min Temp: -55 degC; Polarized: No; Value Display: 0.1uF,100V,0603; Category: Capacitor; ComponentLink1Description: Datasheet; ComponentLink1URL: https://www.yageo.com/upload/media/product/app/datasheet/mlcc/upy-np0x7r_mv_100-to-630v.pdf; Manufacturer Part Number: CC0603KRX7R0BB104; Mount Type: Surface Mount; Package: 0603; RoHS: Yes; Supplier 1: Digikey; Supplier 1 Part Number: 311-1523-1-ND; Supplier 1 pricing per Unit: 14.19 INR; Supplier: Mouser; Supplier Part Number: 603-CC603KRX7R0BB104; Supplier pricing per Unit: 14.19 INR; Technology: Ceramic; Temp Coefficient: X7R; Tolerance: 10%; Value 1: CC0603KRX7R0BB104; Value: 0.1uF; Voltage: 100V
C7-C9 = Cap_GRM188R72A104KA35D: Multilayer Ceramic Capacitor, 100 nF, 100 V, ± 10%, X7R, 0603 [1608 Metric]; Manufacturer: Murata; AEC-Q: NA; Max Temp: 125 degC; Min Temp: -55 degC; Polarized: No; Value: 100 nF; Value Display: 100nF, 100V,0603; Voltage: 100V; Category: Capacitor; ComponentLink1Description: Datasheet; ComponentLink1URL: https://search.murata.co.jp/Ceramy/image/img/A01X/G101/ENG/GRM188R72A104KA35-01.pdf; Manufacturer Part Number: GRM188R72A104KA35D; Mount Type: Surface Mount; Package: 0603; RoHS: Yes; Supplier 1: Digikey; Supplier 1 Part Number: 490-3285-1-ND; Supplier 1 pricing per Unit: 17.71 INR; Supplier: Mouser; Supplier Part Number: 81-GRM188R72A104KA35; Supplier pricing per Unit: 17.71 INR; Technology: Ceramic; Temp Coefficient: X7R; Tolerance: 10%; Value 1: GRM188R72A104KA35D
D1 = Diode_TVS_SMP100LC-140: 140V Off-State 400 A Ipp TVS Thyristor DO-214AA, SMB; Manufacturer: ST; AEC-Q: NA; Category: TVS Diode; ComponentLink1Description: Datasheet; ComponentLink1URL: https://www.st.com/content/ccc/resource/technical/document/datasheet/56/56/46/9e/00/a0/48/db/CD00002051.pdf/files/CD00002051.pdf/jcr:content/translations/en.CD00002051.pdf; Manufacturer Part Number: SMP100LC-140; Max Temp: NA; Min Temp: NA; Mount Type: Surface Mount; Package: DO-214AA, SMB; RoHS: Yes; Supplier 1: Digikey; Supplier 1 Part Number: 497-4088-1-ND; Supplier 1 pricing per Unit: 63.38 INR; Supplier: Mouser; Supplier Part Number: 511-SMP100LC-140; Supplier pricing per Unit: 63.38 INR; Value 1: SMP100LC-140; Value: 140V; Value Display: 140V; Voltage: 140V
D2 D3 = Diode_TVS_SMDJ70A: 113V Clamp 31A Ipp Tvs Diode Surface Mount DO-214AB (SMCJ); Manufacturer: LittleFuse; AEC-Q: NA; Max Temp: 150 degC; Min Temp: -65 degC; Power: 3kW (Peak); Category: TVS Diode; ComponentLink1Description: Datasheet; ComponentLink1URL: https://www.littelfuse.com/media?resourcetype=datasheets&itemid=2d9772b3-822b-4362-914d-b74e0a706638&filename=littelfuse-tvs-diode-smdj-datasheet; Manufacturer Part Number: SMDJ70A; Mount Type: Surface Mount; Package: DO-214AB (SMCJ); RoHS: Yes; Supplier 1: Digikey; Supplier 1 Part Number: SMDJ70ACT-ND; Supplier 1 pricing per Unit: 74.28 INR; Supplier: Mouser; Supplier Part Number: 576-SMDJ70A; Supplier pricing per Unit: 73.39 INR; Value 1: SMDJ70A; Value: 113V; Value Display: 113V; Voltage: 113V
D4-D6 = Diode_MMSZ5246BQ-7-F: Zener Diode 16 V 500 mW ±5% Surface Mount SOD-123; Manufacturer: Diodes Inc.; AEC-Q: 101; Forward Current: 30mA; Forward Voltage: 900 mV @ 10 mA; Max Temp: 150 degC; Min Temp: -65 degC; Power: 370mW; Value: 16V 30mA; Voltage: 16V; Category: Diode; ComponentLink1Description: Datasheet; ComponentLink1URL: https://www.diodes.com/assets/Datasheets/ds18010.pdf; Manufacturer Part Number: MMSZ5246BQ-7-F; Mount Type: Surface Mount; Package: SOD 123; RoHS: Yes; Supplier 1: Digikey; Supplier 1 Part Number: 31-MMSZ5246BQ-7-FTR-ND; Supplier: Mouser; Value 1: MMSZ5246BQ-7-F; Value Display: 16V 30mA; Supplier 1 pricing per Unit: 17.9 INR; Supplier Part Number: 621-MMSZ5246BQ-7-F; Supplier pricing per Unit: 17.71 INR
D7 D8 D10 D11 = Diode_BAT46W-7-F: Diode 100 V 150mA Surface Mount SOD-123; Manufacturer: Diodes Inc.; AEC-Q: NA; Forward Voltage: 450mV @ 10mA; Max Temp: 125 degC; Min Temp: -55 degC; Power: 200mW; Voltage: 100V; Category: Diode; ComponentLink1Description: Datasheet; ComponentLink1URL: https://www.diodes.com/assets/Datasheets/BAT46W.pdf; Forward Current: 150mA; Manufacturer Part Number: BAT46W-7-F; Mount Type: Surface Mount; Package: SOD 123; RoHS: Yes; Supplier 1: Digikey; Supplier 1 Part Number: BAT46W-7FDICT-ND; Supplier 1 pricing per Unit: 32.55 INR; Supplier: Mouser; Supplier Part Number: 621-BAT46W-7-F; Supplier pricing per Unit: 25.02 INR; Value 1: BAT46W-7-F; Value: 100V 150mA; Value Display: 100V 150mA
D9 = Diode_SBAS16HT1G: DIODE GEN PURP 100V 200MA SOD323; Manufacturer: OnSemi; AEC-Q: 101; Max Temp: 150 degC; Min Temp: -55 degC; Forward Voltage: 1.25V @150mA; Power: 200mW; Value: 100V 200mA; Manufacturer Part Number: SBAS16HT1G; Supplier: Mouser; Supplier 1 pricing per Unit: 10.84 INR; Package: SOD 323; Category: Diode; RoHS: Yes; ComponentLink1Description: Datasheet; ComponentLink1URL: https://www.onsemi.com/pdf/datasheet/bas16ht1-d.pdf; Supplier 1: Digikey; Value 1: SBAS16HT1G; Value Display: 100V 200mA; Voltage: 100V; Supplier 1 Part Number: SBAS16HT1GOSCT-ND; Supplier Part Number: 863-SBAS16HT1G; Supplier pricing per Unit: 15.01 INR; Mount Type: Surface Mount; Forward Current: 200mA
FB1 FB2 = FB_74279265: 600 Ohms @ 100 MHz 1 Signal Line Ferrite Bead 0603 (1608 Metric) 200mA 450mOhm; Manufacturer: Wurth Electronik; AEC-Q: 200; Max Temp: 125 degC; Min Temp: -55 degC; Value 1: 600 Ohms @100MHHz; Category: Ferrite Bead; ComponentLink1Description: Datasheet; ComponentLink1URL: https://www.we-online.com/components/products/datasheet/74279265.pdf; Manufacturer Part Number: 74279265; Mount Type: Surface Mount; Package: 0603; RoHS: Yes; Supplier 1: Digikey; Supplier 1 Part Number: 732-1583-1-ND; Supplier 1 pricing per Unit: 15.07 INR; Supplier: Mouser; Supplier Part Number: 710-74279265; Supplier pricing per Unit: 14.10 INR; Value: 74279265; Value Display: 600 Ohms
MT1-MT4 = Mounting Hole M3
Q1 Q2 = FET_ZXMP10A17GQTA: P-Channel 100 V 2.4A (Ta) 2W (Ta) Surface Mount SOT-223-3; Manufacturer: Diodes Inc.; AEC-Q: 101; Forward Voltage: 100V; Max Temp: 150 degC; Min Temp: -55 degC; Rds ON: 350mΩ @ 2.4A @ -10V; Category: MOSFET; ComponentLink1Description: Datasheet; ComponentLink1URL: https://www.diodes.com/assets/Datasheets/ZXMP10A17GQ.pdf; Forward Current: 2.4A; Manufacturer Part Number: ZXMP10A17GQTA; Mount Type: Surface Mount; Package: SOT 23-3; Power: 2W; RoHS: Yes; Supplier 1: Digikey; Supplier 1 Part Number: ZXMP10A17GQTADICT-ND; Supplier 1 pricing per Unit: 85.13 INR; Supplier: Mouser; Supplier Part Number: 621-ZXMP10A17GQTA; Supplier pricing per Unit: 85.07 INR; Value 1: ZXMP10A17GQTA; Value: 100V 2.4A; Value Display: 100V 2.4A; Voltage: 100V; Channel: P-Channel
Q3-Q10 Q42 Q51-Q57 = FET_NVBLS0D8N08XTXG: N-Channel 80 V 457A (Tc) 325W (Tc) Surface Mount 8-HPSOF; Manufacturer: OnSemi; Voltage: 80V; AEC-Q: 101; Max Temp: 175 degC; Min Temp: -55 degC; Rds ON: 0.79mOhms @80A,10V; Manufacturer Part Number: NVBLS0D8N08XTXG; Value: 80V 457A; Package: 8 HPSOF; RoHs: Yes; Category: MOSFET; Supplier: Mouser; Supplier 1 pricing per Unit: 575.53 INR; ComponentLink1Description: Datasheet; ComponentLink1URL: https://www.onsemi.com/download/data-sheet/pdf/nvbls0d8n08x-d.pdf; Supplier 1: Digikey; Value 1: NVBLS0D8N08XTXG; Value Display: 80V 457A; Supplier 1 Part Number: 488-NVBLS0D8N08XTXGCT-ND; Supplier Part Number: 863-NVBLS0D8N08XTXG; Supplier pricing per Unit: 574.63 INR; Mount Type: Surface Mount; Forward Current: 457A; Forward Voltage: 80V; Power: 325W; Channel: N-Channel
Q11 = FET_2N7002KW: N-Channel 60 V 310mA (Ta) 350mW (Ta) Surface Mount SOT-323; Manufacturer: OnSemi; AEC-Q: NA; Forward Voltage: 60V; Max Temp: 150 degC; Min Temp: -55 degC; Rds ON: 1.6Ohms @500mA 10V; Category: MOSFET; ComponentLink1Description: Datasheet; ComponentLink1URL: https://www.onsemi.com/pdf/datasheet/2n7002kw-d.pdf; Forward Current: 310mA; Manufacturer Part Number: 2N7002KW; Mount Type: Surface Mount; Package: SOT 32-3; Power: 350mW; RoHS: Yes; Supplier 1: Digikey; Supplier: Mouser; Value 1: 2N7002KW; Value: 60V 310mA; Value Display: 60V 310mA; Voltage: 60V; Channel: N-Channel
R1-R3 = Res_AC2512FK-7W200RL: 200 Ohms ±1% 2W Chip Resistor 2512 (6432 Metric) Automotive AEC-Q200, Moisture Resistant Thick Film; Manufacturer: Yageo; AEC-Q: 200; Max Temp: 155 degC; Min Temp: -55 degC; Value: 200R; Value Display: 200E, 1%,2512; Category: Resistor; ComponentLink1Description: Datasheet; ComponentLink1URL: https://www.yageo.com/upload/media/product/productsearch/datasheet/rchip/PYu-AC_51_RoHS_L_10.pdf; Manufacturer Part Number: AC2512FK-7W200RL; Mount Type: Surface Mount; Package: 2512; Power: 2W; RoHS: Yes; Supplier 1: Digikey; Supplier 1 Part Number: 13-AC2512FK-7W200RLTR-ND; Supplier 1 pricing per Unit: NA; Supplier: Mouser; Supplier Part Number: 603-AC2512FK-7W200RL; Supplier pricing per Unit: 60.05 INR; Tolerance: 1%; Value 1: AC2512FK-7W200RL
R4-R8 = Res_CRCW060310M0JNEA: SMD Chip Resistor, 10 MOhm,±5%, 100 mW, 0603 [1608 Metric], Thick Film, General Purpose; Manufacturer: Vishay Dale; AEC-Q: 200; Max Temp: 155 degC; Min Temp: -55 degC; Power: 1/10W; Value: 10M R; Value Display: 10ME, 5%, 0603; Category: Resistor; ComponentLink1Description: Datasheet; ComponentLink1URL: https://www.vishay.com/docs/20035/dcrcwe3.pdf; Manufacturer Part Number: CRCW060310M0JNEA; Mount Type: Surface Mount; Package: 0603; RoHS: Yes; Supplier 1: Digikey; Supplier 1 Part Number: 541-10MGCT-ND; Supplier 1 pricing per Unit: 8.34 INR; Supplier: Mouser; Supplier Part Number: 71-CRCW0603J-10M-E3; Supplier pricing per Unit: 8.34 INR; Tolerance: 5%; Value 1: CRCW060310M0JNEA
R9-R13 R15 R16 = Res_CRCW06035K10JNEA: SMD Chip Resistor, 5.1k Ohm, ± 5%, 250 mW, 0603 [1608 Metric], Thick Film, General Purpose; Manufacturer: Vishay Dale; AEC-Q: 200; Max Temp: 155 degC; Min Temp: -55 degC; Power: 1/10W; Value: 5.1k R; Value Display: 5.1kE, 5%,0603; Manufacturer Part Number: CRCW06035K10JNEA; Category: Resistor; ComponentLink1Description: Datasheet; ComponentLink1URL: https://www.vishay.com/docs/20035/dcrcwe3.pdf; Mount Type: Surface Mount; Package: 0603; RoHS: Yes; Supplier 1: Digikey; Supplier 1 Part Number: 541-5.1KGCT-ND; Supplier 1 pricing per Unit: 8.34 INR; Supplier: Mouser; Supplier Part Number: 71-CRCW0603J-5.1K-E3; Supplier pricing per Unit: 8.34 INR; Tolerance: 5%; Value 1: CRCW06035K10JNEA
R14 = Res_CRCW060310K0FKEA: SMD Chip Resistor, 10 kOhm,±1%, 100 mW, 0603 [1608 Metric], Thick Film, General Purpose; Manufacturer: Vishay Dale; AEC-Q: 200; Max Temp: 155 degC; Min Temp: -55 degC; Power: 1/10W; Value: 10k R; Value Display: 10kE, 1%, 0603; Category: Resistor; ComponentLink1Description: Datasheet; ComponentLink1URL: https://www.vishay.com/docs/20035/dcrcwe3.pdf; Manufacturer Part Number: CRCW060310K0FKEA; Mount Type: Surface Mount; Package: 0603; RoHS: Yes; Supplier 1: Digikey; Supplier 1 Part Number: 541-10.0KHCT-ND; Supplier 1 pricing per Unit: 8.34 INR; Supplier: Mouser; Supplier Part Number: 71-CRCW0603-10K-E3; Supplier pricing per Unit: 8.34 INR; Tolerance: 1%; Value 1: CRCW060310K0FKEA
R17 = Res_WSLP2726L5000FEA: 0.5 mOhms ±1% 7W Chip Resistor Nonstandard Anti-Sulfur, Automotive AEC-Q200, Current Sense, Moisture Resistant, Pulse Withstanding Metal Element; Manufacturer: Vishay Dale; AEC-Q: 200; Max Temp: 175 degC; Min Temp: -60 degC; Value: 0.5m R; Value Display: 0.5mE, 1%; Category: Shunt Resistor; ComponentLink1Description: Datasheet; ComponentLink1URL: https://www.vishay.com/docs/30179/wslp2726.pdf; Manufacturer Part Number: WSLP2726L5000FEA; Mount Type: Surface Mount; Package: NS; Power: 7W; RoHS: Yes; Supplier 1: Digikey; Supplier 1 Part Number: 541-4377-1-ND; Supplier 1 pricing per Unit: 237.03 INR; Supplier: Mouser; Supplier Part Number: 71-WSLP2726L5000FEA; Supplier pricing per Unit: 202.66 INR; Tolerance: 1%; Value 1: WSLP2726L5000FEA
R18 R19 = Res_AF0603FR-07100RL: SMD Chip Resistor,100 Ohms ±1%, 1/10W, 0603 (1608 Metric) Anti-Sulfur, Automotive AEC-Q200 Thick Film; Manufacturer: Yageo; Value: 100R; Value Display: 100E, 1%,0603; AEC-Q: 200; Max Temp: 155 degC; Min Temp: -55 degC; Category: Resistor; Tolerance: 1%; Package: 0603; Manufacturer Part Number: AF0603FR-07100RL; RoHS: Yes; Power: 1/10W; Supplier: Mouser; Supplier 1 pricing per Unit: 8.34 INR; ComponentLink1Description: Datasheet; ComponentLink1URL: https://www.yageo.com/upload/media/product/app/datasheet/rchip/pyu-af_51_rohs_l.pdf; Supplier 1: Digikey; Value 1: AF0603FR-07100RL; Supplier 1 Part Number: 13-AC0603FR-10150RLCT-ND; Supplier Part Number: 603-AF0603FR-07100RL; Supplier pricing per Unit: 8.34 INR; Mount Type: Surface Mount
R20-R23 = Res_CRCW12065K10JNEA: SMD Chip Resistor, 5.1k Ohm, ± 5%, 250 mW, 1206 [3216 Metric], Thick Film, General Purpose; Manufacturer: Vishay Dale; AEC-Q: 200; Max Temp: 155 degC; Min Temp: -55 degC; Power: 1/4W; Value: 5.1k R; Value Display: 5.1kE, 5%,1206; Manufacturer Part Number: CRCW12065K10JNEA; Category: Resistor; ComponentLink1Description: Datasheet; ComponentLink1URL: https://www.vishay.com/docs/20035/dcrcwe3.pdf; Mount Type: Surface Mount; Package: 1206; RoHS: Yes; Supplier 1: Digikey; Supplier 1 Part Number: 541-5.1KECT-ND; Supplier 1 pricing per Unit: 8.34 INR; Supplier: Mouser; Supplier Part Number: 71-CRCW1206J-5.1K-E3; Supplier pricing per Unit: 8.34 INR; Tolerance: 5%; Value 1: CRCW12065K10JNEA
T1-T4 = Terminal_7461057: 6 Pin Screw Terminal, Power Tap M3 Through Hole; Manufacturer: Wurth Electronik; Value: 100 A; Value Display: M3 Screw Terminal; Category: Terminal; ComponentLink1Description: Datasheet; ComponentLink1URL: https://www.we-online.com/components/products/datasheet/7461057.pdf; Manufacturer Part Number: 7461057; Mount Type: TH; Package: TH; RoHS: Yes; Supplier 1: Digikey; Supplier 1 Part Number: 732-3200-ND; Supplier 1 pricing per Unit: 213.66 INR; Supplier: Mouser; Supplier Part Number: 710-7461057; Supplier pricing per Unit: 213.30 INR; Value 1: 7461057

## Sheet USB - C.SchDoc
size A3; SheetNumber: 9; SheetTotal: 12
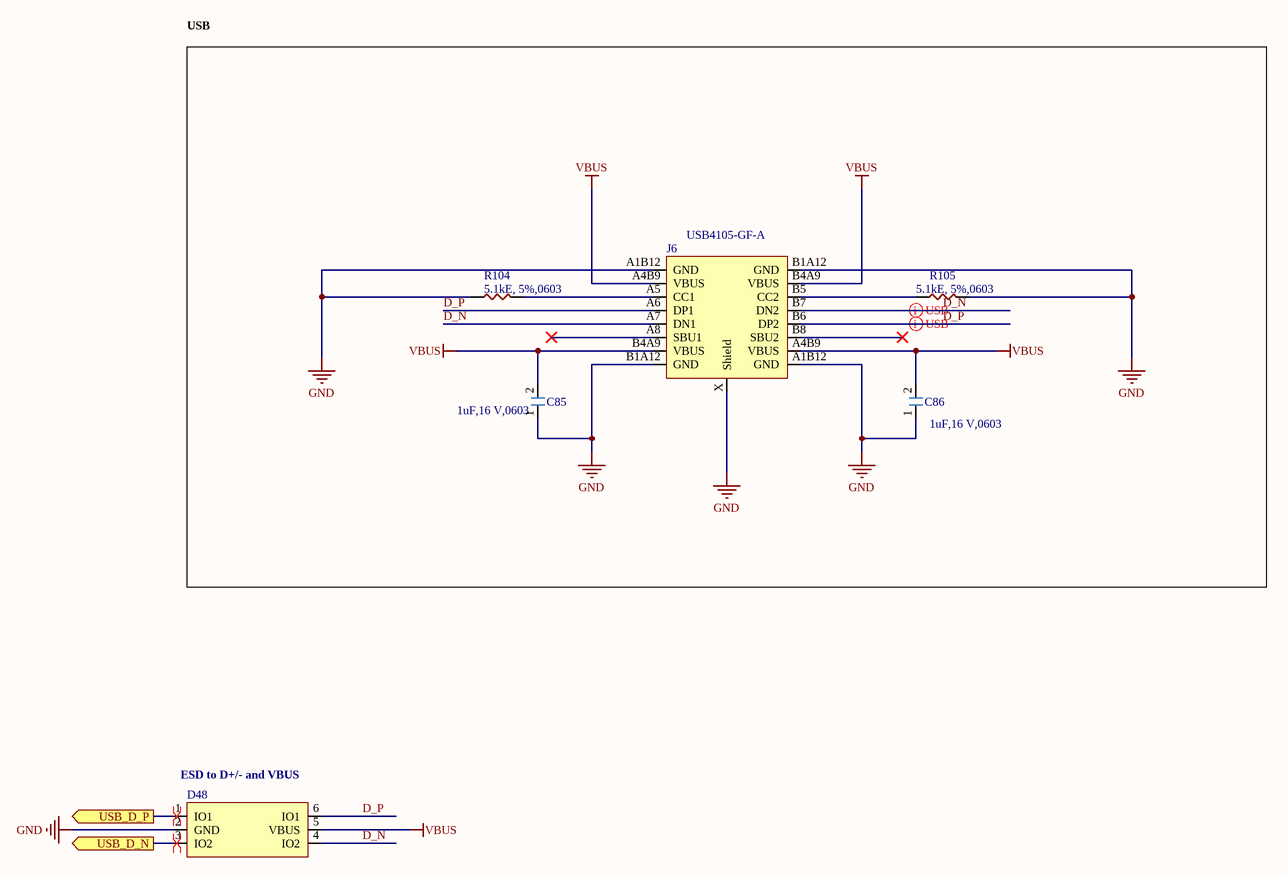
[diagram p6: USB - C.SchDoc]

### Parts
C85  Value Display: 1uF,16 V,0603  [CAPC1608X05N 0603]  (hidden comment: CGA3E1X7R1C105K080AC)
C86  Value Display: 1uF,16 V,0603  [CAPC1608X05N 0603]  (hidden comment: CGA3E1X7R1C105K080AC)
D48  USBLC6-2SC6  [SOT95P280X145-6N]  (value not drawn)
J6  USB4105-GF-A  [Con_USB4105-GF-A]
R104  Value Display: 5.1kE, 5%,0603  [RESC1608X05N 0603]  (hidden comment: CRCW06035K10JNEA)
R105  Value Display: 5.1kE, 5%,0603  [RESC1608X05N 0603]  (hidden comment: CRCW06035K10JNEA)

### Blocks framed on the sheet
USB: C85 C86 J6 R104 R105

### Ports
USB_D_N (out), USB_D_P (out)

### Nets
GND: C85.1 C86.1 D48.2(GND) J6.A1B12(GND) J6.B1A12(GND) J6.X(Shield) R104.1 R105.2
VBUS: C85.2 C86.2 D48.5(VBUS) J6.A4B9(VBUS) J6.B4A9(VBUS)
D_N: D48.4(IO2) J6.A7(DN1) J6.B7(DN2)
D_P: D48.6(IO1) J6.A6(DP1) J6.B6(DP2)
USB_D_N: D48.3(IO2) ; port USB_D_N
USB_D_P: D48.1(IO1) ; port USB_D_P
NetJ6_A5: J6.A5(CC1) R104.2
NetJ6_B5: J6.B5(CC2) R105.1

Not connected (* = marked no-connect by the designer): J6 A8(SBU1)* B8(SBU2)*

### Layout directives
differential pair: D_N, D_P, USB_D_N, USB_D_P

### Notes on the sheet
- (near D48) ESD to D+/- and VBUS

### Library data of the parts
C85 C86 = Cap_CGA3E1X7R1C105K080AC: Multilayer Ceramic Capacitor, 1uF, 16V, ±10%,  X7R 0603 [1608 Metric]; Manufacturer: TDK Corporation; Polarized: No; AEC-Q: 200; Min Temp: -55 degC; Max Temp: 125 degC; Value: 1 uF; Manufacturer Part Number: CGA3E1X7R1C105K080AC; Package: 0603; RoHS: Yes; Mount Type: Surface Mount; Supplier 1: Digikey; Voltage: 16V; Tolerance: 10%; Technology: Ceramic; Value 1: CGA3E1X7R1C105K080AC; Category: Capacitor; ComponentLink1Description: Datasheet; ComponentLink1URL: https://product.tdk.com/system/files/dam/doc/product/capacitor/ceramic/mlcc/catalog/mlcc_automotive_general_en.pdf; Supplier 1 Part Number: 445-12539-1-ND; Supplier 1 pricing per Unit: 10.84 INR; Supplier: Mouser; Supplier Part Number: 810-CGA3E1X7R1C105AC; Supplier pricing per Unit: 10.01 INR; Temp Coefficient: X7R
D48 = Diode_TVS_USBLC6-2SC6: 17V Clamp 5A (8/20µs) Ipp Tvs Diode Surface Mount SOT-23-6; Manufacturer: ST; AEC-Q: NA; Max Temp: 150 degC; Min Temp: -40 degC; Value: 5.25V; Category: TVS Diode; ComponentLink1Description: Datasheet; ComponentLink1URL: https://www.st.com/content/ccc/resource/technical/document/datasheet/06/1d/48/9c/6c/20/4a/b2/CD00050750.pdf/files/CD00050750.pdf/jcr:content/translations/en.CD00050750.pdf; Manufacturer Part Number: USBLC6-2SC6; Mount Type: Surface Mount; Package: SOT 23-6; RoHS: Yes; Supplier 1: Digikey; Supplier 1 Part Number: 497-5235-1-ND; Supplier 1 pricing per Unit: 29.30 INR; Supplier: Mouser; Supplier Part Number: 511-USBLC6-2SC6; Supplier pricing per Unit: 29.19 INR; Value 1: USBLC6-2SC6; Value Display: 5.25V; Voltage: 5.25V
J6 = Con_USB_USB4105-GF-A: USB Type C 2.0 Connector; Manufacturer: GCT; Circuits: 16; No. of Rows: 1; Pitch: 0.5 mm; Value: 16 Pin; Value Display: USB 2.0 Type-C; Category: Connector; ComponentLink1Description: Datasheet; ComponentLink1URL: https://mm.digikey.com/Volume0/opasdata/d220001/medias/docus/5492/USB4105.pdf; Manufacturer Part Number: USB4105-GF-A; Mount Type: Surface Mount; Package: SMT; RoHS: Yes; Supplier 1: Digikey; Supplier 1 Part Number: 2073-USB4105-GF-ACT-ND; Supplier 1 pricing per Unit: 67.8 INR; Supplier: Mouser; Supplier Part Number: 640-USB4105-GF-A; Supplier pricing per Unit: 67.55 INR; Value 1: USB4105-GF-A
R104 R105 = Res_CRCW06035K10JNEA: SMD Chip Resistor, 5.1k Ohm, ± 5%, 250 mW, 0603 [1608 Metric], Thick Film, General Purpose; Manufacturer: Vishay Dale; AEC-Q: 200; Max Temp: 155 degC; Min Temp: -55 degC; Power: 1/10W; Value: 5.1k R; Manufacturer Part Number: CRCW06035K10JNEA; Category: Resistor; ComponentLink1Description: Datasheet; ComponentLink1URL: https://www.vishay.com/docs/20035/dcrcwe3.pdf; Mount Type: Surface Mount; Package: 0603; RoHS: Yes; Supplier 1: Digikey; Supplier 1 Part Number: 541-5.1KGCT-ND; Supplier 1 pricing per Unit: 8.34 INR; Supplier: Mouser; Supplier Part Number: 71-CRCW0603J-5.1K-E3; Supplier pricing per Unit: 8.34 INR; Tolerance: 5%; Value 1: CRCW06035K10JNEA